# EAGLE design HOPE_RFID_V0.1 (EAGLE 6.2)
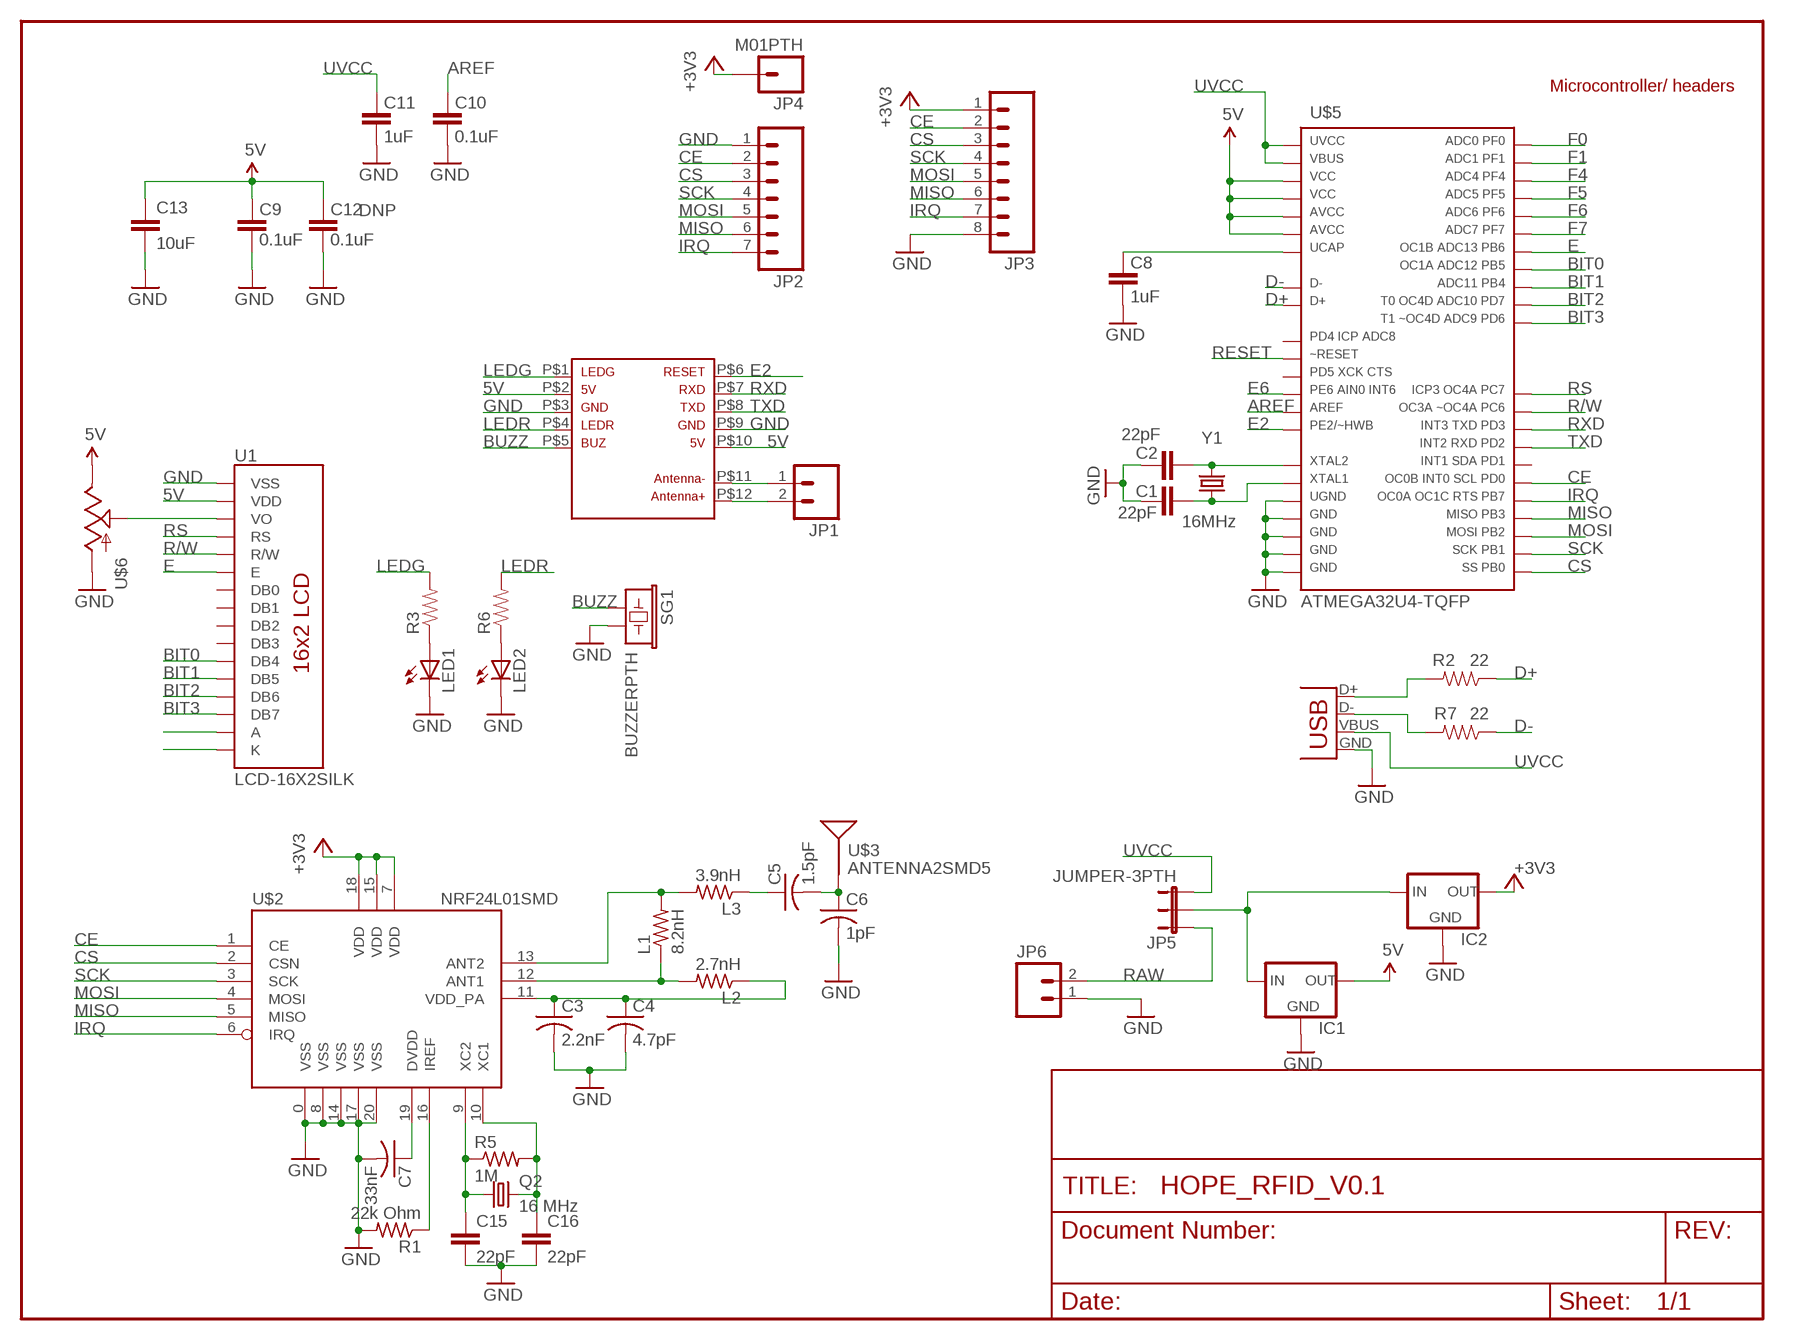
[diagram p0: schematic, sheet 1]

## Parts
C1  22pF  CAP0805  [0805]
C2  22pF  CAP0805  [0805]
C3  2.2nF  C-USC0402  [C0402]
C4  4.7pF  C-USC0402  [C0402]
C5  1.5pF  C-USC0402  [C0402]
C6  1pF  C-USC0402  [C0402]
C7  33nF  C-USC0402  [C0402]
C8  1uF  CAP0603-CAP  [0603-CAP]
C9  0.1uF  CAP0603-CAP  [0603-CAP]
C10  0.1uF  CAP0603-CAP  [0603-CAP]
C11  1uF  CAP0603-CAP  [0603-CAP]
C12  0.1uF  CAP0603-CAP  [0603-CAP]
C13  10uF  C-EUC2012  [C2012]
C15  22pF  CAP0603-CAP  [0603-CAP]
C16  22pF  CAP0603-CAP  [0603-CAP]
IC1  V_REG_78XXSIDE  [78XXL]
IC2  V_REG_78XXSIDE  [78XXL]
JP1  M02PTH  [1X02]
JP2  M07  [1X07]
JP3  M081X08  [1X08]
JP4  M01PTH  [1X01]
JP5  JUMPER-3PTH  [1X03]
JP6  M023.5MM  [SCREWTERMINAL-3.5MM-2]
L1  8.2nH  R-US_R0402  [R0402]
L2  2.7nH  R-US_R0402  [R0402]
L3  3.9nH  R-US_R0402  [R0402]
LED1  LED5MM  [LED5MM]
LED2  LED5MM  [LED5MM]
Q2  16 MHz  CRYSTAL5X3  [CRYSTAL-SMD-5X3]
R1  22k Ohm  R-US_R0805  [R0805]
R2  22  RESISTOR0805-RES  [0805]
R3  RESISTORAXIAL-0.3  [AXIAL-0.3]
R5  1M  R-US_R0805  [R0805]
R6  RESISTORAXIAL-0.3  [AXIAL-0.3]
R7  22  RESISTOR0805-RES  [0805]
SG1  BUZZERPTH  [BUZZER-12MM]
U1  LCD-16X2SILK  [LCD-16X2]
U$1  RDM880  [RDM880]
U$2  NRF24L01SMD  [QFN20]
U$3  ANTENNA2SMD5  [ANTENNA-CHIP5]
U$5  ATMEGA32U4-TQFP  [TQFP44]
U$6  POTTRIM  [TRIM_POT]
X1  USB  [USB-MINIB-NOHOLE]
Y1  16MHz  CRYSTAL  [ABM2-8X4.5-CRYSTAL]

## Nets
5V: C9.2 C12.2 C13.1 IC1.OUT U1.2(VDD) U$1.P$2 U$1.P$10 U$5.14 U$5.24 U$5.34 U$5.44 U$6.2(E)
+3V3: IC2.OUT JP3.1 JP4.1 U$2.7(VDD) U$2.15(VDD) U$2.18(VDD)
AREF: C10.2 U$5.42
BIT0: U1.11(DB4) U$5.29
BIT1: U1.12(DB5) U$5.28
BIT2: U1.13(DB6) U$5.27
BIT3: U1.14(DB7) U$5.26
BUZZ: SG1.+ U$1.P$5
CE: JP2.2 JP3.2 U$2.1(CE) U$5.18
CS: JP2.3 JP3.3 U$2.2(CSN) U$5.8
D+: R2.1 U$5.4
D-: R7.1 U$5.3
E: U1.6(E) U$5.30
E2: U$1.P$6 U$5.33
E6: U$5.1
F0: U$5.41
F1: U$5.40
F4: U$5.39
F5: U$5.38
F6: U$5.37
F7: U$5.36
GND: C1.2 C2.2 C3.2 C4.2 C6.2 C7.2 C8.1 C9.1 C10.1 C11.1 C12.1 C13.2 C15.2 C16.2 IC1.GND IC2.GND JP2.1 JP3.8 JP6.1 LED1.K(C) LED2.K(C) R1.2 SG1.- U1.1(VSS) U$1.P$3 U$1.P$9 U$2.0(VSS) U$2.8(VSS) U$2.14(VSS) U$2.17(VSS) U$2.20(VSS) U$5.5 U$5.15 U$5.23 U$5.35 U$5.43 U$6.3(A) X1.GND
IRQ: JP2.7 JP3.7 U$2.6(IRQ) U$5.12
LEDG: R3.P$2 U$1.P$1
LEDR: R6.P$2 U$1.P$4
MISO: JP2.6 JP3.6 U$2.5(MISO) U$5.11
MOSI: JP2.5 JP3.5 U$2.4(MOSI) U$5.10
N$1: JP1.1 U$1.P$11
N$2: JP1.2 U$1.P$12
N$3: C15.1 Q2.1 R5.1 U$2.9(XC2)
N$4: C1.1 U$5.16 Y1.P$1
N$5: C3.1 C4.1 L2.1 U$2.11(VDD_PA)
N$6: L1.1 L2.2 U$2.12(ANT1)
N$7: L1.2 L3.2 U$2.13(ANT2)
N$8: C5.1 L3.1
N$9: C5.2 C6.1 U$3.FEED(SIGNAL)
N$10: C2.1 U$5.17 Y1.P$2
N$11: IC1.IN IC2.IN JP5.2
N$12: C7.1 U$2.19(DVDD)
N$13: R1.1 U$2.16(IREF)
N$14: C8.2 U$5.6
N$15: R7.2 X1.D-
N$16: R2.2 X1.D+
N$17: LED1.A R3.P$1
N$18: LED2.A R6.P$1
N$19: U1.3(VO) U$6.1(S)
N$27: U1.15(A)
N$28: U1.16(K)
N$29: C16.1 Q2.3 R5.2 U$2.10(XC1)
R/W: U1.5(R/W) U$5.31
RAW: JP5.1 JP6.2
RESET: U$5.13
RS: U1.4(RS) U$5.32
RXD: U$1.P$7 U$5.21
SCK: JP2.4 JP3.4 U$2.3(SCK) U$5.9
TXD: U$1.P$8 U$5.20
UVCC: C11.2 JP5.3 U$5.2 U$5.7 X1.VBUS
Unconnected: U1.7(DB0) U1.8(DB1) U1.9(DB2) U1.10(DB3) U$5.19 U$5.22 U$5.25

## Notes on the sheet
- Microcontroller/ headers
- DNP

## Library data of the parts
C1 C2 C8-C12 C15 C16 = SparkFun:CAP: Capacitor Standard 0603 ceramic capacitor, and 0.1" leaded capacitor.
C3-C7 = rcl:C-US: CAPACITOR, American symbol
C13 = resistor:C-EU: CAPACITOR, European symbol
IC1 IC2 = SparkFun:V_REG_78XX: Voltage Regulator Standard 7805 5V regulator. IGO (Input Ground Output). Spark Fun Electronics SKU : COM-00107
JP1 JP6 = SparkFun:M02: Header 2 Standard 2-pin 0.1" header. Use with straight break away headers (SKU : PRT-00116), right angle break away headers (PRT-00553), swiss pins (PRT-00743), machine pins (PRT-00117), and female headers (PRT-00115). Molex polarized connector foot print use with SKU : PRT-08233 with associated crimp pins and housings.
JP2 = SparkFun:M07: Header 7 Standard 7-pin 0.1" header. Use with straight break away headers (SKU : PRT-00116), right angle break away headers (PRT-00553), swiss pins (PRT-00743), machine pins (PRT-00117), and female headers (PRT-00115). NOTES ON THE VARIANTS LOCK and LOCK_LONGPADS... This footprint was designed to help hold the alignment of a through-hole component (i.e. 7-pin header) while soldering it into place. You may notice that each hole has been shifted either up or down by 0.005 of an inch from it's more standard position (which is usually a perfectly straight line). This slight alteration caused the pins (the squares in the middle) to touch the edges of the holes. Because they are alternating, it causes a "brace" to hold the header in place. 0.005 has proven to be the perfect amount of "off-center" position when using our standard breakaway headers. Although looks a little odd when you look at the bare footprint, once you have a header in there, the alteration is very hard to notice. Also, if you push a header all the way into place, it is covered up entirely on the bottom side. This idea of altering the position of holes to aid alignment will be further integrated into the Sparkfun Library for other footprints. It can help hold any component with 3 or more connection pins.
JP3 = SparkFun:M08: Header 8 Standard 8-pin 0.1" header. Use with straight break away headers (SKU : PRT-00116), right angle break away headers (PRT-00553), swiss pins (PRT-00743), machine pins (PRT-00117), and female headers (PRT-00115).
JP4 = SparkFun:M01: Header 1 Standard 1-pin 0.1" header. Use with straight break away headers (SKU : PRT-00116), right angle break away headers (PRT-00553), swiss pins (PRT-00743), machine pins (PRT-00117), and female headers (PRT-00115).
JP5 = SparkFun:JUMPER-3
L1-L3 = rcl:R-US_: RESISTOR, American symbol
LED1 LED2 = SparkFun:LED: LEDs Standard schematic elements and footprints for 5mm, 3mm, 1206, and 0603 sized LEDs. 5mm - Spark Fun Electronics SKU : COM-00529 (and others)
Q2 = SparkFun:CRYSTAL: Crystals Various standard crystals. Proven footprints. Spark Fun Electronics SKU : COM-00534
R1 R5 = resistor:R-US_: RESISTOR, American symbol
R2 R3 R6 R7 = SparkFun:RESISTOR: Resistor Basic schematic elements and footprints for 0603, 1206, and PTH resistors.
SG1 = SparkFun:BUZZER: Buzzer 12mm Spark Fun Electronics SKU : Comp-Buzzer
U1 = SparkFun:LCD-16X2
U$1 = Homebrew:RDM880
U$2 = SparkFun:NRF24L01: 2.4GHz Low Power Transceiver This is the very popular, low cost, very low power RF transceiver from Nordic Semiconductor. Simple SPI interface. SKU: COM-00690
U$3 = SparkFun:ANTENNA2: Antenna Single endded antenna. Common with smaller chip antennas. CHIP4 package is the GPS Chip Antenna SKU: GPS-08418. CHIP5 package is 2.4GHz chip antenna SKU: WRL-00144.
U$5 = Homebrew:ATMEGA32U4-TQFP
U$6 = SparkFun:POT
X1 = SparkFun:USB: USB Connectors USB-B-PTH is fully proven SKU : PRT-00139 USB-miniB is fully proven SKU : PRT-00587 USB-A-PCB is untested. USB-A-H is throughly reviewed, but untested. Spark Fun Electronics SKU : PRT-00437 USB-B-SMT is throughly reviewed, but untested. Needs silkscreen touching up. USB-A-S has not been used/tested USB-MB-H has not been used/tested
Y1 = Homebrew:CRYSTAL: Crystals Various standard crystals. Proven footprints. Spark Fun Electronics SKU : COM-00534

## Board
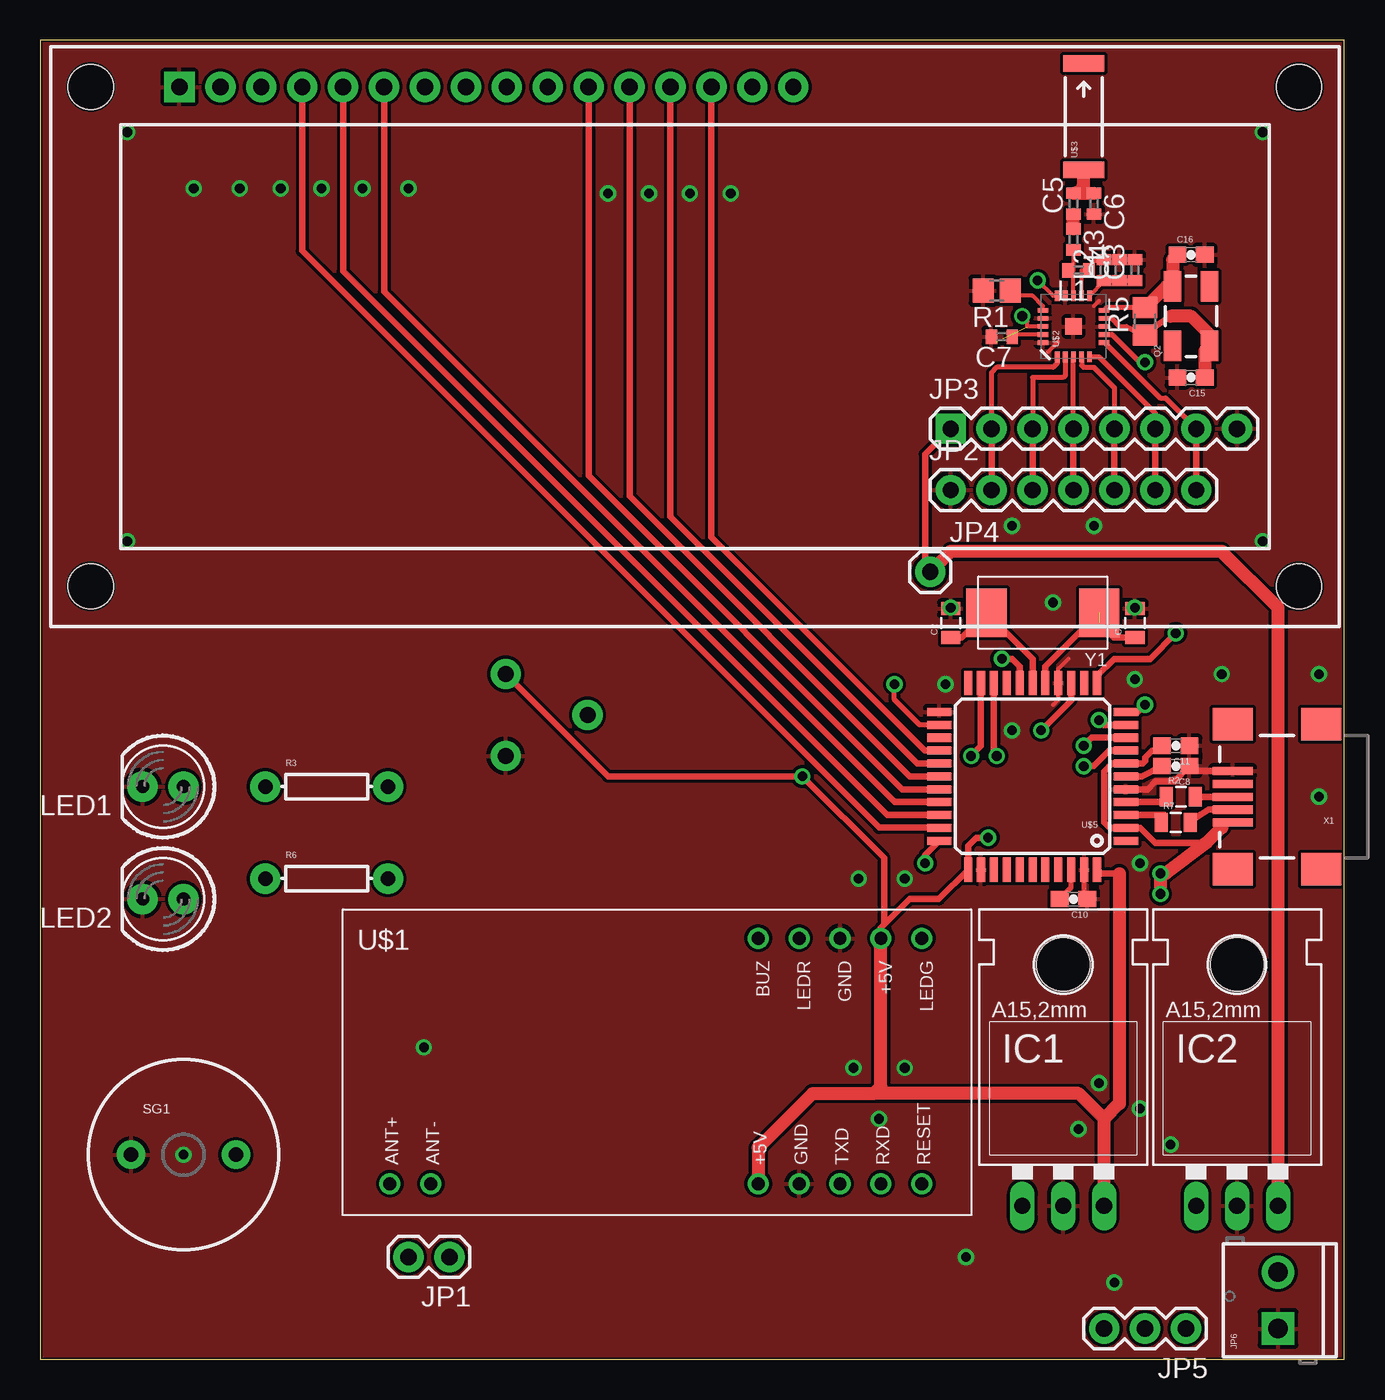
[diagram p1: board, top side]
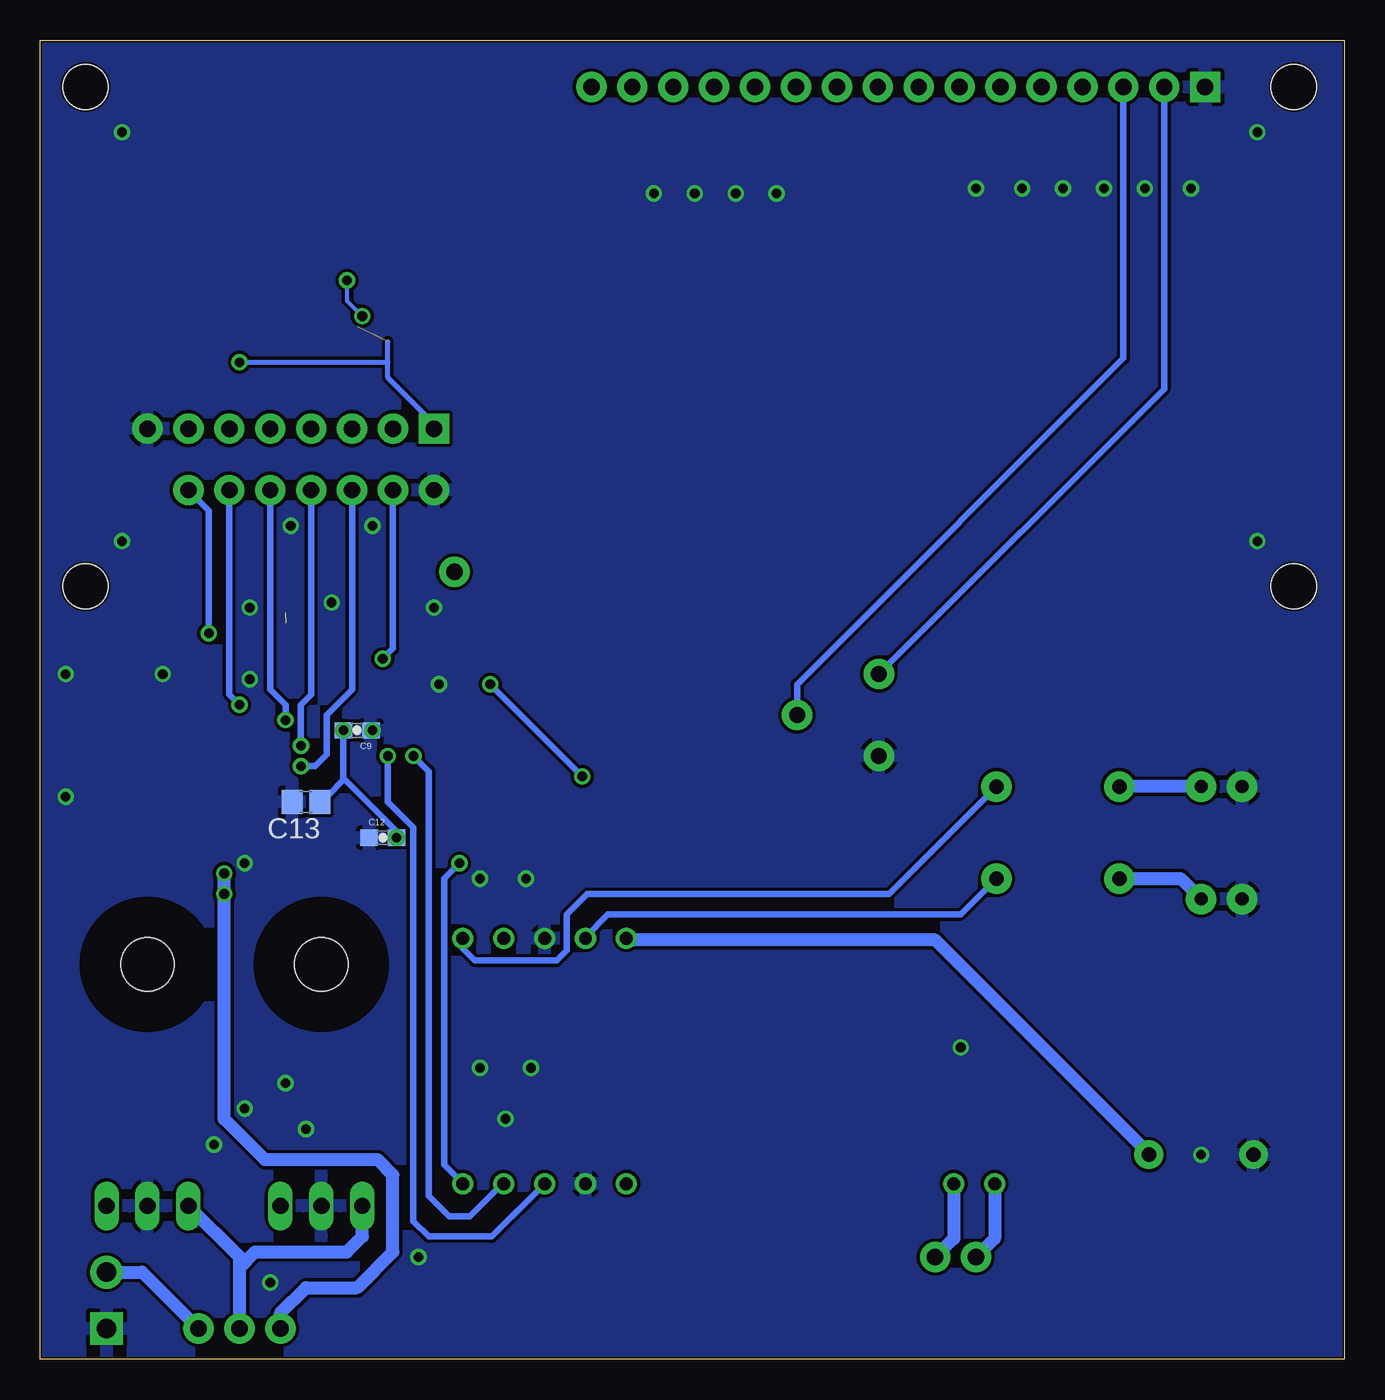
[diagram p2: board, bottom side, seen from below]

Size 80.95 x 81.91 mm. Coordinates in mm from the lower left corner, seen from the top.
Outline: 0,0 80.95,0 80.95,81.91 0,81.91 0,0
Copper layers (1*16): Top 0.035mm / dielectric 1.5mm / Bottom 0.035mm
Design rules: minimum track width 10mil, minimum drill 24mil, track to track 8mil, track to pad 8mil, pad to pad 8mil, via to via 8mil, smd to smd 8mil, copper to edge 5mil, drill to drill 8mil, minimum pad ring 10mil, minimum via ring 8mil, stop-mask expansion 4mil, vias tented up to drill 0mil, thermal gap 10mil

### Footprints (pad centres in the part's own frame; a part is rotated, then mirrored left to right if it is on the bottom)
0805 = smd 0.8 x 1.2: 1 -0.9,0; 2 0.9,0
C0402 = smd 0.7 x 0.9: 1 -0.65,0; 2 0.65,0
0603-CAP = smd 1.1 x 1: 1 -0.85,0; 2 0.85,0
C2012 = smd 1.3 x 1.5: 1 -0.85,0; 2 0.85,0
78XXL = drill 1.016 long: GND 0,-3.81; IN -2.54,-3.81; OUT 2.54,-3.81 | hole 3.302: 0,11.176
1X02 = drill 1.016 pad 1.88: 1 0,0; 2 2.54,0
1X07 = drill 1.016 pad 1.88: 1 0,0; 2 2.54,0; 3 5.08,0; 4 7.62,0; 5 10.16,0; 6 12.7,0; 7 15.24,0
1X08 = drill 1.016 pad 1.88 square: 1 0,0 | drill 1.016 pad 1.88: 2 2.54,0; 3 5.08,0; 4 7.62,0; 5 10.16,0; 6 12.7,0; 7 15.24,0; 8 17.78,0
1X01 = drill 1.016 pad 1.88: 1 0,0
1X03 = drill 1.016 pad 1.88: 1 0,0; 2 2.54,0; 3 5.08,0
SCREWTERMINAL-3.5MM-2 = drill 1.2 pad 2.032 square: 1 0,0 | drill 1.2 pad 2.032: 2 3.5,0
R0402 = smd 0.7 x 0.9: 1 -0.65,0; 2 0.65,0
LED5MM = drill 0.813 pad 1.88: A -1.27,0; K 1.27,0
CRYSTAL-SMD-5X3 = smd 1.9 x 1.1: 1 -1.85,-1.15; 2 1.85,-1.15; 3 1.85,1.15; 4 -1.85,1.15
R0805 = smd 1.3 x 1.5: 1 -0.85,0; 2 0.85,0
AXIAL-0.3 = drill 0.9 pad 1.88: P$1 -3.81,0; P$2 3.81,0
BUZZER-12MM = drill 0.9 pad 1.778: + 3.25,0; - -3.25,0
LCD-16X2 = drill 1.016 pad 1.88 square: 1 -32,15.5 | drill 1.016 pad 1.88: 2 -29.46,15.5; 3 -26.92,15.5; 4 -24.38,15.5; 5 -21.84,15.5; 6 -19.3,15.5; 7 -16.76,15.5; 8 -14.22,15.5; 9 -11.68,15.5; 10 -9.14,15.5; 11 -6.6,15.5; 12 -4.06,15.5; 13 -1.52,15.5; 14 1.02,15.5; 15 3.56,15.5; 16 6.1,15.5 | hole 2.8: -37.5,15.5; -37.5,-15.5; 37.5,15.5; 37.5,-15.5
RDM880 = drill 0.8: P$1 15.99,7.09; P$2 13.45,7.09; P$3 10.91,7.09; P$4 8.37,7.09; P$5 5.83,7.09; P$6 15.99,-8.15; P$7 13.45,-8.15; P$8 10.91,-8.15; P$9 8.37,-8.15; P$10 5.83,-8.15; P$11 -14.49,-8.15; P$12 -17.03,-8.15
QFN20 = smd 1 x 1: 0 0,0 | smd 0.65 x 0.3: 1 -1.9,1; 2 -1.9,0.5; 3 -1.9,0; 4 -1.9,-0.5; 5 -1.9,-1; 11 1.9,-1; 12 1.9,-0.5; 13 1.9,0; 14 1.9,0.5; 15 1.9,1 | smd 0.3 x 0.65: 6 -1,-1.9; 7 -0.5,-1.9; 8 0,-1.9; 9 0.5,-1.9; 10 1,-1.9; 16 1,1.9; 17 0.5,1.9; 18 0,1.9; 19 -0.5,1.9; 20 -1,1.9
ANTENNA-CHIP5 = smd 1.016 x 2.54: FEED -3.302,0; NC 3.302,0
TQFP44 = smd 1.5 x 0.5: 1 -5.8,4; 2 -5.8,3.2; 3 -5.8,2.4; 4 -5.8,1.6; 5 -5.8,0.8; 6 -5.8,0; 7 -5.8,-0.8; 8 -5.8,-1.6; 9 -5.8,-2.4; 10 -5.8,-3.2; 11 -5.8,-4; 23 5.8,-4; 24 5.8,-3.2; 25 5.8,-2.4; 26 5.8,-1.6; 27 5.8,-0.8; 28 5.8,0; 29 5.8,0.8; 30 5.8,1.6; 31 5.8,2.4; 32 5.8,3.2; 33 5.8,4 | smd 0.5 x 1.5: 12 -4,-5.8; 13 -3.2,-5.8; 14 -2.4,-5.8; 15 -1.6,-5.8; 16 -0.8,-5.8; 17 0,-5.8; 18 0.8,-5.8; 19 1.6,-5.8; 20 2.4,-5.8; 21 3.2,-5.8; 22 4,-5.8; 34 4,5.8; 35 3.2,5.8; 36 2.4,5.8; 37 1.6,5.8; 38 0.8,5.8; 39 0,5.8; 40 -0.8,5.8; 41 -1.6,5.8; 42 -2.4,5.8; 43 -3.2,5.8; 44 -4,5.8
TRIM_POT = drill 1 pad 1.88: 1 5.08,0; 2 0,2.54; 3 0,-2.54
USB-MINIB-NOHOLE = smd 2.5 x 0.5: D+ 3.77,0; D- 3.77,0.8; GND 3.77,-1.6; ID 3.77,-0.8; VBUS 3.77,1.6 | smd 2.5 x 2: G1 -1.73,-4.5; G2 -1.73,4.5; G3 3.77,4.5; G4 3.77,-4.5
ABM2-8X4.5-CRYSTAL = smd 2.5 x 3: P$1 -3.5,0; P$2 3.5,0

### Placement (x,y rotation side)
C1  67.94,45.72 90 top
C2  56.52,45.72 90 top
C3  67.94,67.63 90 top
C4  66.99,67.63 90 top
C5  64.14,71.75 90 top
C6  65.41,71.75 270 top
C7  59.69,63.5 180 top
C8  70.48,36.83 180 top
C9  61.28,39.05 180 bottom
C10  64.14,28.57 180 top
C11  70.48,38.1 180 top
C12  59.69,32.38 0 bottom
C13  64.45,34.61 180 bottom
C15  71.44,60.96 180 top
C16  71.44,68.58 0 top
IC1  63.5,13.34 0 top
IC2  74.3,13.34 0 top
JP1  25.4,6.35 180 top
JP2  56.52,53.98 0 top
JP3  56.52,57.78 0 top
JP4  55.24,48.9 0 top
JP5  71.12,1.91 180 top
JP6  76.83,1.91 90 top
L1  64.45,67.63 180 top
L2  66.04,67.63 90 top
L3  64.14,69.53 270 top
LED1  7.62,35.56 180 top
LED2  7.62,28.57 180 top
Q2  71.44,64.77 90 top
R1  59.37,66.36 180 top
R2  70.8,34.92 0 top
R3  17.78,35.56 0 top
R5  68.58,64.45 90 top
R6  17.78,29.84 0 top
R7  70.48,33.34 0 top
SG1  8.89,12.7 0 top
U1  40.64,63.5 0 top
U$1  38.73,19.05 0 top
U$2  64.14,64.14 90 top
U$3  64.77,77.15 90 top
U$5  61.59,36.2 180 top
U$6  28.89,40.01 0 top
X1  77.79,34.92 180 top
Y1  62.23,46.35 180 top

### Tracks (layer width: path | path; a pad name or v marks a point on that pad's centre or on a via)
5V  (via drill 0.6)
  Top 0.305: U$5.24 54.59,39.4 53.02,40.96 v53.02,41.91
  Top 0.406: U$6.2 35.24,36.2 v47.31,36.2 52.39,31.11 52.39,26.99 | U$5.44 65.83,30.16 66.99,30.16 | 52.39,26.99 52.19,26.79 U$1.P$2 | C12.2 58.1,32.38 57.59,31.88 U$5.34 55.77,28.57 53.98,28.57 52.39,26.99 | U$5.14 63.99,40.92 C9.2
  Top 0.813: IC1.OUT 66.04,14.92 | 66.04,14.92 64.45,16.51 51.75,16.51 | U$1.P$10 44.56,13.13 47.94,16.51 51.75,16.51 | 51.75,16.51 52.19,16.94 U$1.P$2 | 66.99,30.16 66.99,15.88 66.04,14.92
  Bottom 0.406: U1.2 11.18,60.26 U$6.2 | v53.02,41.91 v47.31,36.2 | C9.2 62.13,36.09 62.07,36.04 | 62.07,36.04 58.84,32.8 C12.2 | C13.1 63.18,34.61 63.18,34.92 62.07,36.04
  other vias: 58.84,32.38 62.13,39.05
+3V3  (via drill 0.6)  (1 unrouted)
  Top 0.254: U$2.18 61.28,64.14 61.28,64.45 v60.96,64.77 | U$2.15 62.87,66.03 v61.91,66.99
  Top 0.305: U$2.7 66.54,63.63 68.26,61.91 v68.58,61.91
  Top 0.406: JP3.1 54.93,56.2 54.93,49.21 JP4.1
  Top 0.813: IC2.OUT 76.83,46.67 73.34,50.16 56.52,50.16 JP4.1
  Bottom 0.254: v61.91,66.99 61.91,65.72 v60.96,64.77
  Bottom 0.305: JP3.1 56.52,58.1 59.37,60.96 59.37,61.91 | 59.37,61.91 59.37,63.18 | v68.58,61.91 59.37,61.91
AREF
  Top 0.305: C10.2 63.99,29.29 U$5.42
BIT0
  Top 0.406: U1.11 34.04,54.86 53.51,35.4 U$5.29
BIT1
  Top 0.406: U1.12 36.58,53.59 53.98,36.2 U$5.28
BIT2
  Top 0.406: U1.13 39.12,52.32 54.45,36.99 U$5.27
BIT3
  Top 0.406: U1.14 41.66,51.05 54.91,37.8 U$5.26
BUZZ
  Bottom 0.813: SG1.+ 12.14,12.78 25.4,26.04 44.46,26.04 U$1.P$5
CE  (via drill 0.6)
  Top 0.305: U$2.1 63.13,61.87 62.87,61.59 59.37,61.59 59.05,61.28 JP3.2
  Top 0.406: JP3.2 JP2.2 | U$5.18 60.8,43.03 60.33,43.5 v59.69,43.5
  Bottom 0.406: v59.69,43.5 59.05,44.13 JP2.2
CS  (via drill 0.6)
  Top 0.305: U$2.2 63.63,61.09 63.5,60.96 61.59,60.96 JP3.3
  Top 0.406: JP3.3 JP2.3 | U$5.8 66.37,37.8 65.41,36.83 v64.77,36.83
  Bottom 0.406: v64.77,36.83 63.89,36.83 63.18,37.54 63.18,40.01 61.59,41.59 JP2.3
D+
  Top 0.406: R2.1 69.85,34.61 67.41,34.61 U$5.4
D-
  Top 0.406: U$5.3 69.76,33.8 R7.1
E
  Top 0.406: U1.6 21.34,66.29 53.03,34.59 U$5.30
E2  (via drill 0.6)
  Top 0.406: U$5.33 54.93,31.33 v54.93,30.8
  Bottom 0.406: v54.93,30.8 55.88,29.84 55.88,12.06 U$1.P$6
GND  (via drill 0.6)
  Top 0.254: 65.41,65.41 65.72,65.72 | 62.55,62.55 63.18,63.18 | U$5.15 63.2,40.97 63.18,40.96 | 62.87,40.64 63.18,40.96 | 63.18,40.96 63.18,42.86 63.82,43.5
  Top 0.305: C10.1 64.8,28.77 U$5.43
  Top 0.406: X1.GND 71.64,36.52 C8.1 70.38,35.88 69.22,35.88 68.73,35.4 U$5.5
  other vias: 60.33,39.05 56.2,41.91 67.94,42.23 68.26,30.8 53.66,29.84 50.8,29.84 53.66,18.1 50.48,18.1 52.07,14.92 68.26,15.56 65.72,17.14 64.45,14.29 70.17,13.34 57.47,6.35 66.67,4.76 23.81,19.37 8.89,12.7 9.53,72.71 12.38,72.71 14.92,72.71 17.46,72.71 20,72.71 22.86,72.71 35.24,72.39 37.78,72.39 40.32,72.39 42.86,72.39 75.88,76.2 75.88,50.8 5.4,50.8 5.4,76.2 67.94,46.67 56.52,46.67 62.87,46.99 60.33,51.75 65.41,51.75 79.38,34.92 79.38,42.55 73.34,42.55
  pour Bottom: 0,81.92 0,0 80.64,0 80.96,0 80.96,81.92
  pour Top: 0,81.92 0,0 80.96,0 80.96,81.92
IRQ  (via drill 0.6)
  Top 0.305: U$2.6 66.09,63.13 69.53,59.69 69.85,59.69 JP3.7
  Top 0.406: JP3.7 JP2.7 | U$5.12 65.59,42.42 66.67,43.5 68.9,43.5 v70.48,45.09
  Bottom 0.406: v70.48,45.09 70.48,52.7 JP2.7
LEDG
  Bottom 0.406: U$1.P$1 54.73,25.52 53.98,24.77 48.9,24.77 48.26,25.4 48.26,27.62 46.99,28.89 28.26,28.89 R3.P$2
LEDR
  Bottom 0.406: U$1.P$4 47.1,26.24 45.72,27.62 23.81,27.62 R6.P$2
MISO  (via drill 0.6)
  Top 0.305: JP3.6 69.22,58.74 65.72,62.23 U$2.5
  Top 0.406: JP3.6 JP2.6 | U$5.11 68.14,40.2 v68.58,40.64
  Bottom 0.406: v68.58,40.64 69.22,41.27 JP2.6
MOSI  (via drill 0.6)
  Top 0.305: U$2.4 64.64,61.73 64.77,61.59 65.41,61.59 66.67,60.33 JP3.5
  Top 0.406: JP3.5 JP2.5 | U$5.10 66.02,39.4 v65.72,39.69
  Bottom 0.406: v65.72,39.69 65.72,40.64 66.67,41.59 JP2.5
N$1
  Bottom 0.813: U$1.P$11 24.25,7.5 JP1.1
N$2
  Bottom 0.813: U$1.P$12 21.7,7.5 JP1.2
N$3
  Top 0.305: U$2.9 66.49,64.64 66.99,64.14 67.41,64.14 R5.1
  Top 0.406: R5.1 68.36,63.6 70.17,64.77
  Top 0.813: C15.1 72.29,62.62 Q2.1 72.59,63.62 71.44,64.77 70.17,64.77
N$4  (1 unrouted)
  Top 0.406: U$5.16 62.4,43.02 Y1.P$1 | C1.1 66.62,44.82 65.72,45.72
N$5
  Top 0.254: U$2.11 L2.1 C4.1 C3.1
N$6
  Top 0.254: U$2.12 64.64,67.63 L1.1 arc-90 65.75,68.28 L2.2
N$7
  Top 0.254: U$2.13 64.14,67.63 | 64.14,67.63 63.82,67.63 | 63.82,67.63 L1.2 | 63.82,67.63 64.14,67.94 | 64.14,67.94 64.14,67.63 | 64.14,67.94 L3.2 64.14,68.9
N$8
  Top 0.813: L3.1 C5.1
N$9
  Top 0.813: C6.1 C5.2 arc90 64.77,73.04 U$3.FEED
N$10
  Top 0.406: U$5.17 61.59,43.49 Y1.P$2 57.2,44.82 C2.1
N$11
  Bottom 0.813: IC2.IN 68.58,6.35 JP5.2 68.58,5.71 67.63,6.67 61.91,6.67 60.96,7.62 IC1.IN
N$12
  Top 0.254: U$2.19 60.48,63.63 C7.1
N$13
  Top 0.254: U$2.16 62.23,65.4 61.59,66.04 60.54,66.04 R1.1
N$14
  Top 0.406: U$5.6 68.36,36.2 C8.2
N$15
  Top 0.406: X1.D- 72.54,34.12 71.75,33.66 71.75,33.71 R7.2
N$16
  Top 0.406: X1.D+ R2.2
N$17
  Bottom 0.813: LED1.A R3.P$1
N$18
  Bottom 0.813: R6.P$1 10.16,29.84 LED2.A
N$19
  Bottom 0.406: U1.3 13.72,62.16 33.97,41.91 U$6.1
N$29
  Top 0.305: R5.2 66.2,65.3 U$2.10
  Top 0.813: C16.1 70.29,68.28 Q2.3 69.9,66.62 R5.2
R/W
  Top 0.406: U1.5 18.8,67.56 52.56,33.8 U$5.31
RAW
  Bottom 0.813: JP6.2 74.62,5.41 JP5.1
RS
  Top 0.406: U1.4 16.26,68.83 52.07,33.02 55.77,33.02 U$5.32
RXD  (via drill 0.6)
  Top 0.406: U$5.21 58.4,38.08 v57.78,37.47
  Bottom 0.406: v57.78,37.47 56.83,36.51 56.83,10.16 55.56,8.89 54.29,8.89 52.28,10.9 U$1.P$7
SCK  (via drill 0.6)
  Top 0.305: JP3.4 U$2.3
  Top 0.406: JP3.4 JP2.4 | U$5.9 65.27,38.59 v64.77,38.1
  Bottom 0.406: v64.77,38.1 64.77,40.64 64.14,41.27 JP2.4
TXD  (via drill 0.6)
  Top 0.406: U$5.20 59.2,37.64 v59.37,37.47
  Bottom 0.406: 59.37,37.15 v59.37,37.47 59.37,34.61 57.78,33.02 57.78,8.57 56.83,7.62 52.92,7.62 U$1.P$8 51.66,8.89
UVCC  (via drill 0.6)
  Top 0.254: 73.34,33.02 73.39,33.02 X1.VBUS
  Top 0.406: X1.VBUS 73.65,33.33 72.39,32.07 69.22,32.07 68.29,32.99 U$5.2 66.38,32.99 66.04,33.34 66.04,36.51 66.52,36.99 U$5.7 68.43,36.99 68.58,37.15 68.58,37.36 69,37.78 C11.2
  Top 0.813: v69.53,28.89 v69.53,30.16 69.85,30.16 72.39,32.07 73.34,33.02
  Bottom 0.813: JP5.3 66.04,2.86 64.45,4.45 61.28,4.45 59.05,6.67 59.05,11.43 60.01,12.38 66.99,12.38 69.53,14.92 v69.53,28.89 v69.53,30.16